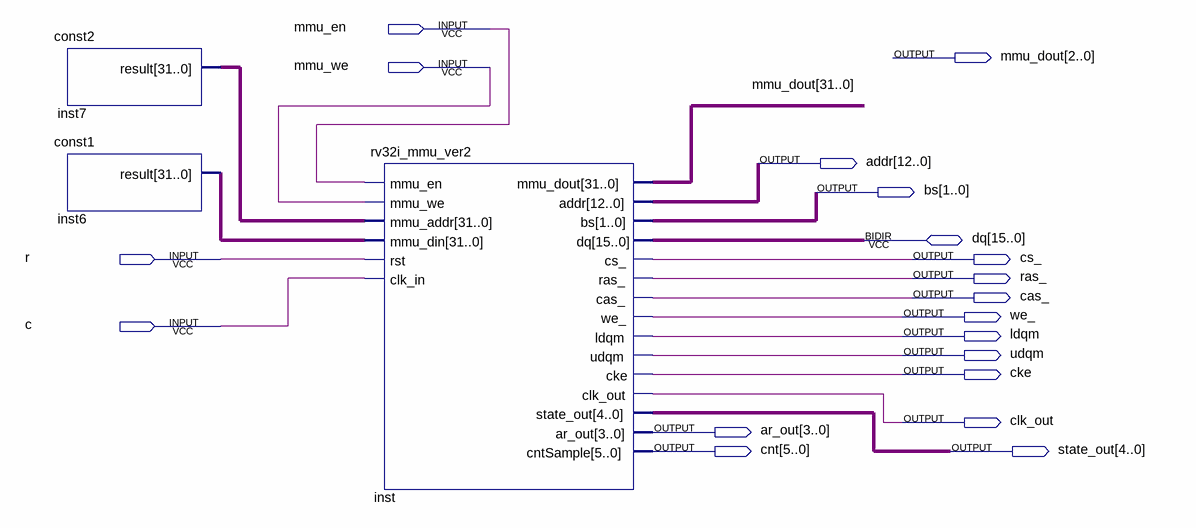
[diagram p0: schematic sheet]
// Quartus schematic mmu_ver2_tester.bdf as structural Verilog: 3 symbols, 19 pins
module mmu_ver2_tester (
  input  mmu_en,
  input  mmu_we,
  input  r,
  input  c,
  inout  [15:0] dq,
  output [31:0] mmu_dout,
  output [12:0] addr,
  output [1:0] bs,
  output cs_,
  output ras_,
  output cas_,
  output we_,
  output ldqm,
  output udqm,
  output cke,
  output clk_out,
  output [3:0] ar_out,
  output [5:0] cnt,
  output [4:0] state_out
);

  wire [31:0] inst6_result, inst7_result;

  const2 inst7 (.result(inst7_result));
  const1 inst6 (.result(inst6_result));
  rv32i_mmu_ver2 inst (
    .mmu_en(mmu_en), .mmu_we(mmu_we), .mmu_addr(inst7_result), .mmu_din(inst6_result), .rst(r), .clk_in(c),
    .mmu_dout(mmu_dout), .addr(addr), .bs(bs), .cs_(cs_), .ras_(ras_), .cas_(cas_), .we_(we_), .ldqm(ldqm),
    .udqm(udqm), .cke(cke), .clk_out(clk_out), .state_out(state_out), .ar_out(ar_out), .cntSample(cnt),
    .dq(dq));
endmodule
